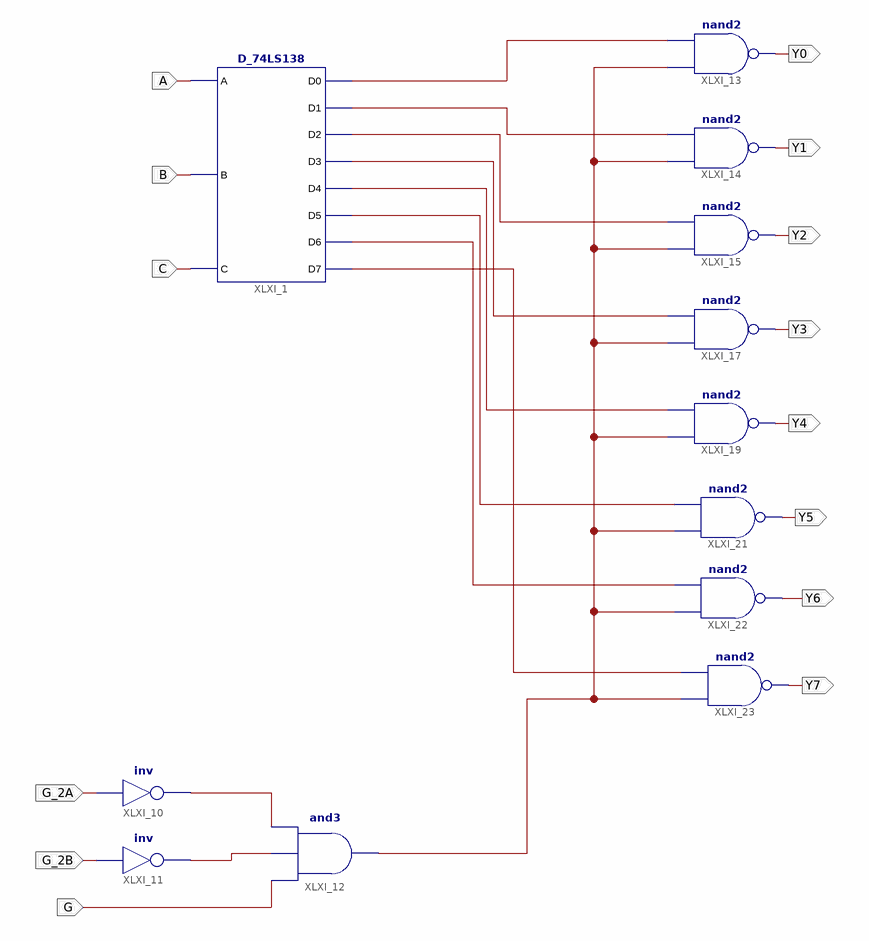
[diagram p0: schematic sheet 1]
// Xilinx ISE schematic HCT138sch.sch (kintex7) as structural Verilog: 12 symbols, 14 ports
module HCT138sch (
  input  A,
  input  B,
  input  C,
  input  G_2A,
  input  G_2B,
  input  G,
  output Y0,
  output Y1,
  output Y2,
  output Y3,
  output Y4,
  output Y5,
  output Y6,
  output Y7
);

  wire XLXN_4, XLXN_5, XLXN_6, XLXN_7, XLXN_8, XLXN_9, XLXN_10, XLXN_11, XLXN_14, XLXN_15, XLXN_19;

  D_74LS138 XLXI_1 (
    .A(A), .B(B), .C(C), .D0(XLXN_4), .D1(XLXN_5), .D2(XLXN_6), .D3(XLXN_7), .D4(XLXN_8), .D5(XLXN_9),
    .D6(XLXN_10), .D7(XLXN_11));
  not XLXI_10 (XLXN_14, G_2A);
  not XLXI_11 (XLXN_15, G_2B);
  and XLXI_12 (XLXN_19, G, XLXN_15, XLXN_14);
  nand XLXI_13 (Y0, XLXN_19, XLXN_4);
  nand XLXI_14 (Y1, XLXN_19, XLXN_5);
  nand XLXI_15 (Y2, XLXN_19, XLXN_6);
  nand XLXI_17 (Y3, XLXN_19, XLXN_7);
  nand XLXI_19 (Y4, XLXN_19, XLXN_8);
  nand XLXI_21 (Y5, XLXN_19, XLXN_9);
  nand XLXI_22 (Y6, XLXN_19, XLXN_10);
  nand XLXI_23 (Y7, XLXN_19, XLXN_11);
endmodule
